# EAGLE schematic Gameboy_Cartridge (EAGLE 8.5.1)
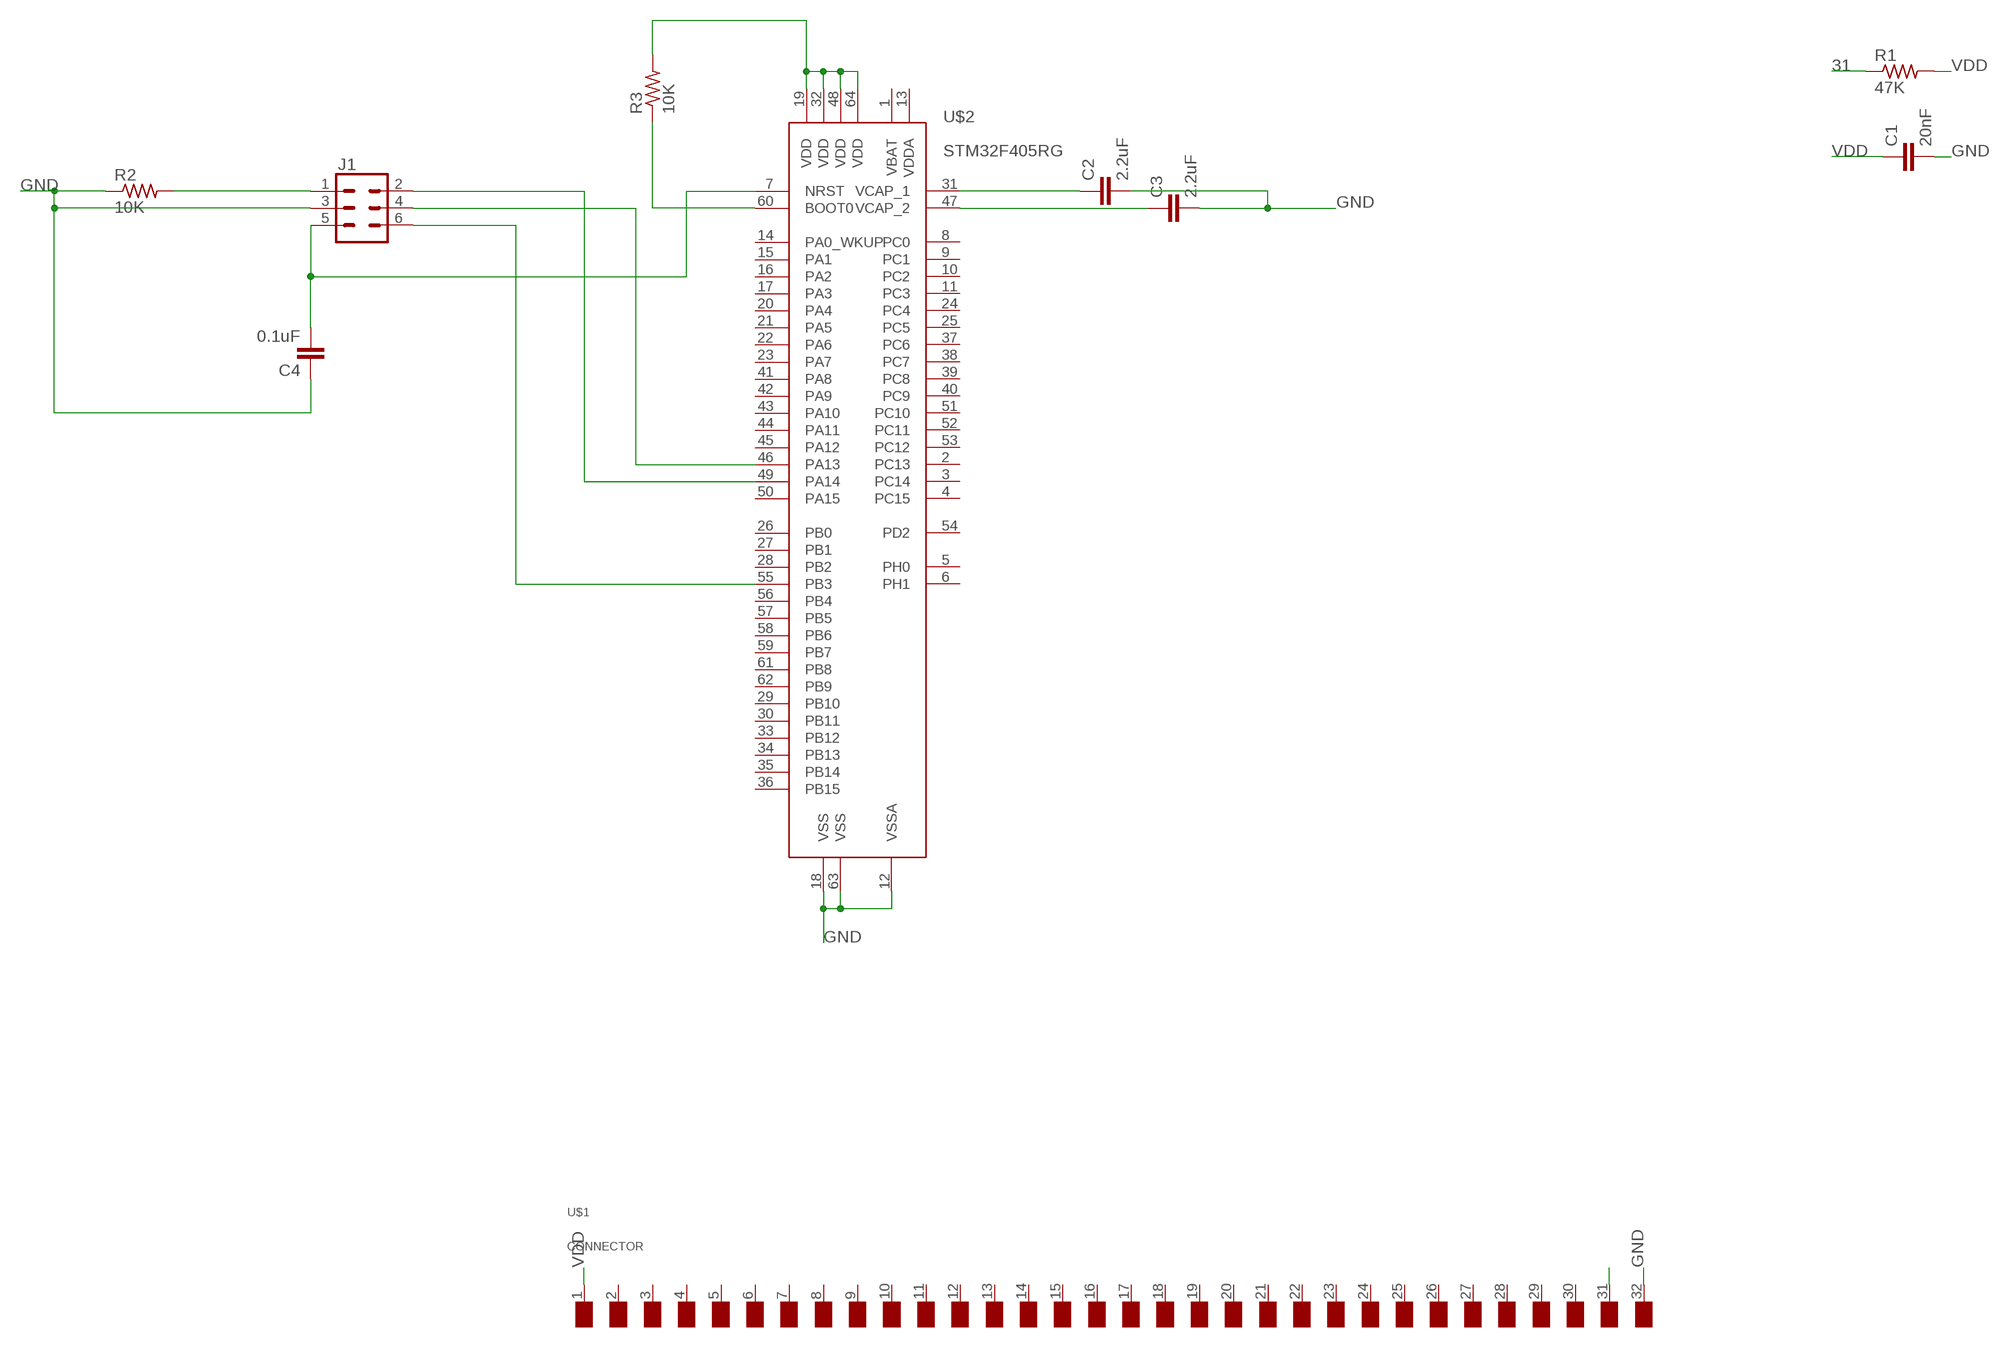
[diagram p0: schematic, sheet 1]

## Parts
C1  20nF  C-EUC0805  [C0805]
C2  2.2uF  C-EUC0805  [C0805]
C3  2.2uF  C-EUC0805  [C0805]
C4  0.1uF  C-EUC0805  [C0805]
J1  CONN_03X2FEMALE_SMD  [2X3_SMD]
R1  47K  R-US_M0805  [M0805]
R2  10K  R-US_M0805  [M0805]
R3  10K  R-US_M0805  [M0805]
U$1  CONNECTOR  [CONNECTOR]
U$2  STM32F405RG  [STM32F405RG]

## Nets
31: R1.1 U$1.31(VIN)
GND: C1.2 U$1.32(GND)
N$1: R3.2 U$2.19(VDD) U$2.32(VDD) U$2.48(VDD) U$2.64(VDD)
N$2: U$2.12(VSSA) U$2.18(VSS) U$2.63(VSS)
N$3: J1.1 R2.2
N$4: C4.1 J1.3 R2.1
N$5: J1.2 U$2.49(PA14)
N$6: R3.1 U$2.60(BOOT0)
N$7: J1.4 U$2.46(PA13)
N$8: C4.2 J1.5 U$2.7(NRST)
N$9: J1.6 U$2.55(PB3)
N$10: C2.1 U$2.31(VCAP_1)
N$11: C3.1 U$2.47(VCAP_2)
N$12: C2.2 C3.2
VDD: C1.1 R1.2 U$1.1(VDD)
Unconnected: U$1.2(NC) U$1.3(/WR) U$1.4(/RD) U$1.5(/RCS) U$1.6(A0) U$1.7(A1) U$1.8(A2) U$1.9(A3) U$1.10(A4) U$1.11(A5) U$1.12(A6) U$1.13(A7) U$1.14(A8) U$1.15(A9) U$1.16(A10) U$1.17(A11) U$1.18(A12) U$1.19(A13) U$1.20(A14) U$1.21(A15) U$1.22(D0) U$1.23(D1) U$1.24(D2) U$1.25(D3) U$1.26(D4) U$1.27(D5) U$1.28(D6) U$1.29(D7) U$1.30(/RS) U$2.2(PC13) U$2.3(PC14) U$2.4(PC15) U$2.5(PH0) U$2.6(PH1) U$2.8(PC0) U$2.9(PC1) U$2.10(PC2) U$2.11(PC3) U$2.14(PA0_WKUP) U$2.15(PA1) U$2.16(PA2) U$2.17(PA3) U$2.20(PA4) U$2.21(PA5) U$2.22(PA6) U$2.23(PA7) U$2.24(PC4) U$2.25(PC5) U$2.26(PB0) U$2.27(PB1) U$2.28(PB2) U$2.29(PB10) U$2.30(PB11) U$2.33(PB12) U$2.34(PB13) U$2.35(PB14) U$2.36(PB15) U$2.37(PC6) U$2.38(PC7) U$2.39(PC8) U$2.40(PC9) U$2.41(PA8) U$2.42(PA9) U$2.43(PA10) U$2.44(PA11) U$2.45(PA12) U$2.50(PA15) U$2.51(PC10) U$2.52(PC11) U$2.53(PC12) U$2.54(PD2) U$2.56(PB4) U$2.57(PB5) U$2.58(PB6) U$2.59(PB7) U$2.61(PB8) U$2.62(PB9)

## Power pins joined to a net without a drawn wire
VBAT: U$2.1(VBAT)
VDDA: U$2.13(VDDA)

## Library data of the parts
C1-C4 = resistor:C-EU: CAPACITOR, European symbol
J1 = SparkFun-Connectors:CONN_03X2: Multi connection point. Often used as Generic Header-pin footprint for 0.1 inch spaced/style header connections You can populate with any combo of single row headers, but if you'd like an exact match, check these: Header - 2x3 (Male, 0.1") <https://www.sparkfun.com/products/12807> (PRT-12807) Header - 2x3 (Female, 0.1") <https://www.sparkfun.com/products/13010> (PRT-13010) 2x3 Pin Shrouded Header <https://www.sparkfun.com/products/10877> (PRT-10877) On any of the 0.1 inch spaced packages, you can populate with these: Break Away Headers - Straight <https://www.sparkfun.com/products/116> (PRT-00116) Break Away Male Headers - Right Angle <https://www.sparkfun.com/products/553> (PRT-00553) Female Headers <https://www.sparkfun.com/products/115> (PRT-00115) Break Away Headers - Machine Pin <https://www.sparkfun.com/products/117> (PRT-00117) Break Away Female Headers - Swiss Machine Pin <https://www.sparkfun.com/products/743> (PRT-00743) Special note: the shrouded connector mates well with our 3x2 ribbon cables: Ribbon Crimp Connector - 6-pin (2x3, Female) <https://www.sparkfun.com/products/10651> (PRT-10651) Ribbon Cable - 6 wire (15ft) <https://www.sparkfun.com/products/10646> (PRT-10646); PROD_ID: CONN-11290
R1-R3 = resistor:R-US_: RESISTOR, American symbol
U$1 = gameboy:CONNECTOR: Connector Pads for Gameboy Cartridges
U$2 = gameboy:STM32F405RG: IC MCU 32BIT 1MB FLASH 64LQFP